# EAGLE schematic ADB (EAGLE 8.6.0)

## Sheet 1 of 2
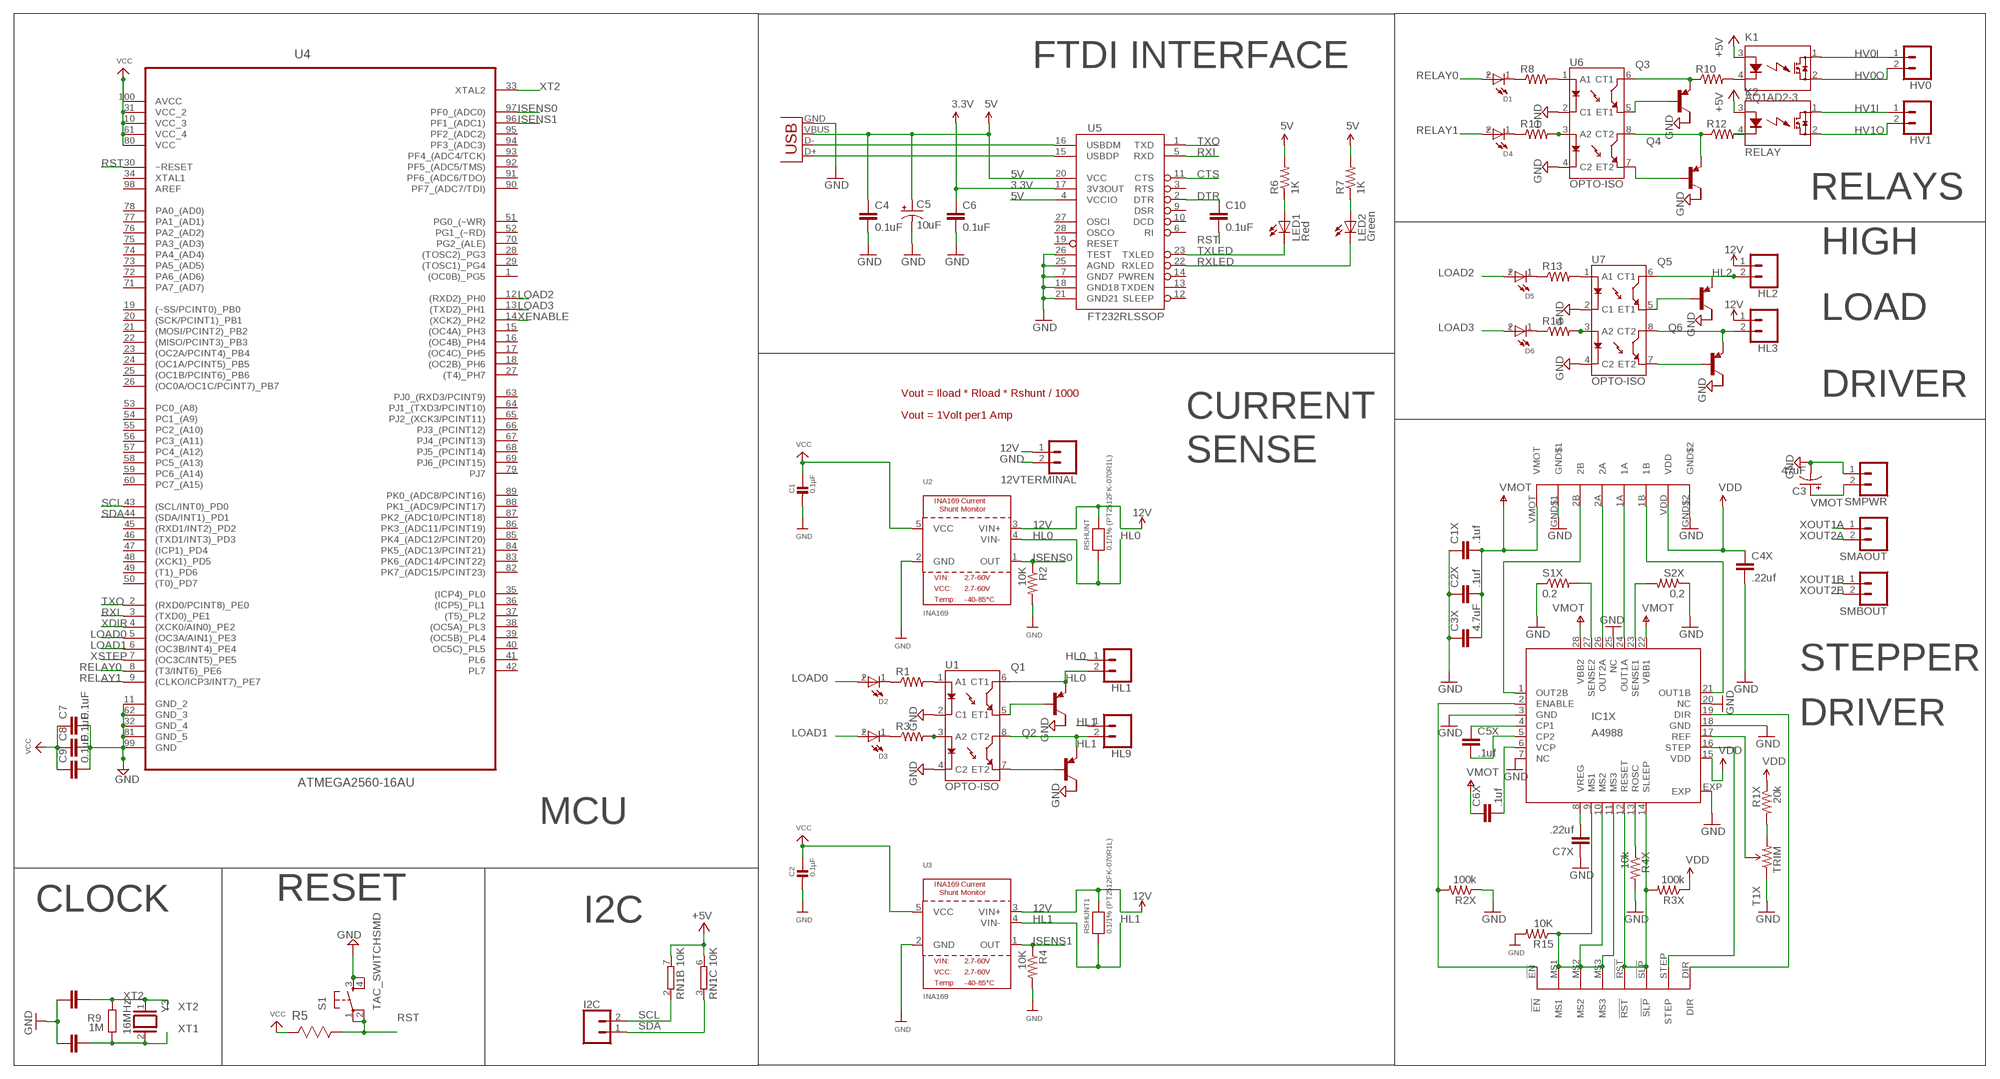
[diagram p0: schematic, sheet 1, part 1 of 2]
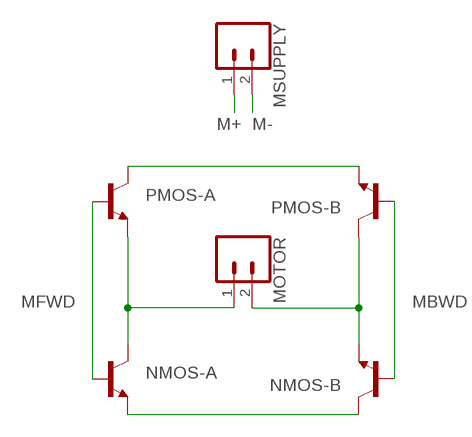
[diagram p1: schematic, sheet 1, part 2 of 2]

### Parts
12VTERMINAL  CONN_023.5MM_LOCK  [SCREWTERMINAL-3.5MM-2_LOCK]
C1  0.1µF  CAP_CERAMIC0805  [0805]
C1X  .1uf  CAP0402-CAP  [0402-CAP]
C2  0.1µF  CAP_CERAMIC0805  [0805]
C2X  .1uf  CAP0402-CAP  [0402-CAP]
C3  47uF  47UF-POLAR-EIA3528-10V-10%  [EIA3528]
C3X  4.7uF  CAP1206  [1206]
C4  0.1uF  CAP0402-CAP  [0402-CAP]
C4X  .22uf  CAP0402-CAP  [0402-CAP]
C5  10uF  CAP_POL1206  [EIA3216]
C5X  .1uf  CAP0402-CAP  [0402-CAP]
C6  0.1uF  CAP0402-CAP  [0402-CAP]
C6X  .1uf  CAP0402-CAP  [0402-CAP]
C7  0.1uF  0.1UF-0603-25V-(+80/-20%)  [0603]
C7X  .22uf  CAP0402-CAP  [0402-CAP]
C8  0.1uF  0.1UF-0603-25V-(+80/-20%)  [0603]
C9  0.1uF  0.1UF-0603-25V-(+80/-20%)  [0603]
C10  0.1uF  0.1UF-0603-25V-(+80/-20%)  [0603]
C23  22p  C-EU0603-RND  [C0603-ROUND]
C24  22p  C-EU0603-RND  [C0603-ROUND]
D1  WL-SMRW_1206_156120YS75000-Y  [WL-SMRW-1206-RECT]
D2  WL-SMRW_1206_156120YS75000-Y  [WL-SMRW-1206-RECT]
D3  WL-SMRW_1206_156120YS75000-Y  [WL-SMRW-1206-RECT]
D4  WL-SMRW_1206_156120YS75000-Y  [WL-SMRW-1206-RECT]
D5  WL-SMRW_1206_156120YS75000-Y  [WL-SMRW-1206-RECT]
D6  WL-SMRW_1206_156120YS75000-Y  [WL-SMRW-1206-RECT]
HL1  CONN_023.5MM_LOCK  [SCREWTERMINAL-3.5MM-2_LOCK]
HL2  CONN_023.5MM_LOCK  [SCREWTERMINAL-3.5MM-2_LOCK]
HL3  CONN_023.5MM_LOCK  [SCREWTERMINAL-3.5MM-2_LOCK]
HL9  CONN_023.5MM_LOCK  [SCREWTERMINAL-3.5MM-2_LOCK]
HV0  CONN_023.5MM_LOCK  [SCREWTERMINAL-3.5MM-2_LOCK]
HV1  CONN_023.5MM_LOCK  [SCREWTERMINAL-3.5MM-2_LOCK]
I2C  CONN_023.5MM_LOCK  [SCREWTERMINAL-3.5MM-2_LOCK]
IC1X  A4988  A4983  [QFN28ET]
J1X  CLONOLU  [CLONOLU]
K1  AQ1AD2-3  [AQ1]
K2  RELAY  AQ1AD2-3  [AQ1]
LED1  Red  LED0603  [LED-0603]
LED2  Green  LED0603  [LED-0603]
MOTOR  CONN_025MM  [SCREWTERMINAL-5MM-2]
MSUPPLY  CONN_025MM  [SCREWTERMINAL-5MM-2]
NMOS-A  TRANSISTOR_NPN"  [SOT223]
NMOS-B  TRANSISTOR_NPN"  [SOT223]
PMOS-A  TRANSISTOR_NPN"  [SOT223]
PMOS-B  TRANSISTOR_NPN"  [SOT223]
Q1  PNP-TRANSISTIOR-2COLSOT89  [SOT89]
Q2  PNP-TRANSISTIOR-2COLSOT89  [SOT89]
Q3  PNP-TRANSISTIOR-2COLSOT89  [SOT89]
Q4  PNP-TRANSISTIOR-2COLSOT89  [SOT89]
Q5  PNP-TRANSISTIOR-2COLSOT89  [SOT89]
Q6  PNP-TRANSISTIOR-2COLSOT89  [SOT89]
R1  FLIPFLOP-RES  [0805-THM]
R1X  20k  RESISTOR0402-RES  [0402-RES]
R2  10K  RESISTOR_DUAL  [0805-THM]
R2X  100k  RESISTOR0402-RES  [0402-RES]
R3  FLIPFLOP-RES  [0805-THM]
R3X  100k  RESISTOR0402-RES  [0402-RES]
R4  10K  RESISTOR_DUAL  [0805-THM]
R4X  10k  RESISTOR0402-RES  [0402-RES]
R5  CRM0805-FW-R050ELF  [RESC2013X65N]
R6  1K  RESISTOR0402-RES  [0402-RES]
R7  1K  RESISTOR0402-RES  [0402-RES]
R8  FLIPFLOP-RES  [0805-THM]
R9  1M  R-EU_R0603  [R0603-ROUND]
R10  FLIPFLOP-RES  [0805-THM]
R11  FLIPFLOP-RES  [0805-THM]
R12  FLIPFLOP-RES  [0805-THM]
R13  FLIPFLOP-RES  [0805-THM]
R14  FLIPFLOP-RES  [0805-THM]
R15  10K  RESISTOR_DUAL  [0805-THM]
RN1  10K  4R-NCAT16  [CAT16]
RSHUNT  0.1/1% (PT2512FK-070R1L)  RESISTOR2512  [2512]
RSHUNT1  0.1/1% (PT2512FK-070R1L)  RESISTOR2512  [2512]
S1  TAC_SWITCHSMD  [TACTILE-SWITCH-SMD]
S1X  0.2  RESISTOR  [0805]
S2X  0.2  RESISTOR  [0805]
SMAOUT  CONN_023.5MM_LOCK  [SCREWTERMINAL-3.5MM-2_LOCK]
SMBOUT  CONN_023.5MM_LOCK  [SCREWTERMINAL-3.5MM-2_LOCK]
SMPWR  CONN_023.5MM_LOCK  [SCREWTERMINAL-3.5MM-2_LOCK]
T1X  TRIM  TRIMPOTSMD  [TRIMPOT-3MM]
U1  OPTO-ISO  ILD213T-IDL213T  [SO08]
U2  INA169  [SOT23-5]
U3  INA169  [SOT23-5]
U4  ATMEGA2560-16AU  [QFP50P1600X1600X120-100N]
U5  FT232RLSSOP  [SSOP28DB]
U6  OPTO-ISO  ILD213T-IDL213T  [SO08]
U7  OPTO-ISO  ILD213T-IDL213T  [SO08]
X2  USB-SMD-NS  [USB-MINIB-NOSTOP]
Y3  16MHz  XTAL/S  [QS]

### Nets
3.3V [power]: C6.1 U5.17(3V3OUT)
5V: C4.1 C5.A(+) R6.2 R7.2 U5.4(VCCIO) U5.20(VCC) X2.VBUS
12V: 12VTERMINAL.1 HL2.1 HL3.1 RSHUNT1.2 RSHUNT.2 U2.3(VIN+) U3.3(VIN+)
+5V [power usb]: K1.3(A) K2.3(A) RN1.6 RN1.7
CTS: U5.11(CTS)
DTR: C10.1 U5.2(DTR)
GND: 12VTERMINAL.2 C1.2 C1X.1 C2.2 C2X.1 C3.C(-) C3X.1 C4.2 C4X.2 C5.C(-) C6.2 C7.2 C7X.1 C8.2 C9.2 C23.2 C24.2 IC1X.3(GND) IC1X.7(NC) IC1X.18(GND) IC1X.20(NC) IC1X.25(NC) IC1X.EXP J1X.GND$1(A4983$2:GND$1) J1X.GND$2(A4983$2:GND$2) Q1.2(C) Q2.2(C) Q3.2(C) Q4.2(C) Q5.2(C) Q6.2(C) R2.2 R2X.1 R4.2 R4X.2 R15.2 S1.3 S1.4 S1X.1 S2X.1 SMPWR.1 T1X.1(CCW) U1.2(C1) U1.4(C2) U2.2(GND) U3.2(GND) U4.11(GND_2) U4.32(GND_4) U4.62(GND_3) U4.81(GND_5) U4.99(GND) U5.7(GND7) U5.18(GND18) U5.21(GND21) U5.25(AGND) U5.26(TEST) U6.2(C1) U6.4(C2) U7.2(C1) U7.4(C2) X2.GND
HL0: HL1.1 HL1.2 Q1.3(E) RSHUNT.1 U1.6(CT1) U2.4(VIN-)
HL1: HL9.1 HL9.2 Q2.3(E) RSHUNT1.1 U1.8(CT2) U3.4(VIN-)
HL2: HL2.2 Q5.3(E) U7.6(CT1)
HL3: HL3.2 Q6.3(E) U7.8(CT2)
HV0I: HV0.1 K1.1(DS1)
HV0O: HV0.2 K1.2(DS2)
HV1I: HV1.1 K2.1(DS1)
HV1O: HV1.2 K2.2(DS2)
ISENS0: R2.1 U2.1(OUT) U4.97(PF0_(ADC0))
ISENS1: R4.1 U3.1(OUT) U4.96(PF1_(ADC1))
LOAD0: D2.2(+) U4.5((OC3A/AIN1)_PE3)
LOAD1: D3.2(+) U4.6((OC3B/INT4)_PE4)
LOAD2: D5.2(+) U4.12((RXD2)_PH0)
LOAD3: D6.2(+) U4.13((TXD2)_PH1)
M+: MSUPPLY.1
M-: MSUPPLY.2
MBWD: NMOS-B.1(B) PMOS-B.1(B)
MFWD: NMOS-A.1(B) PMOS-A.1(B)
N$1: R1.2 U1.1(A1)
N$2: D2.1(-) R1.1
N$3: R3.2 U1.3(A2)
N$4: D3.1(-) R3.1
N$5: Q1.1(B) U1.5(ET1)
N$6: MOTOR.1 NMOS-A.2(C) PMOS-A.3(E)
N$7: Q2.1(B) U1.7(ET2)
N$8: MOTOR.2 NMOS-B.3(E) PMOS-B.2(C)
N$9: LED1.A R6.1
N$10: LED2.A R7.1
N$11: R8.2 U6.1(A1)
N$12: D1.1(-) R8.1
N$13: R11.2 U6.3(A2)
N$14: D4.1(-) R11.1
N$15: Q3.3(E) R10.1 U6.6(CT1)
N$16: K1.4(K) R10.2
N$17: Q4.3(E) R12.1 U6.8(CT2)
N$18: K2.4(K) R12.2
N$19: Q3.1(B) U6.5(ET1)
N$20: Q4.1(B) U6.7(ET2)
N$21: R13.2 U7.1(A1)
N$22: D5.1(-) R13.1
N$23: R14.2 U7.3(A2)
N$24: D6.1(-) R14.1
N$25: Q5.1(B) U7.5(ET1)
N$26: Q6.1(B) U7.7(ET2)
N$27: PMOS-A.2(C) PMOS-B.3(E)
N$28: NMOS-A.3(E) NMOS-B.2(C)
RELAY0: D1.2(+) U4.8((T3/INT6)_PE6)
RELAY1: D4.2(+) U4.9((CLKO/ICP3/INT7)_PE7)
RST: C10.2 R5.1(R1) S1.1 S1.2 U4.30(~RESET)
RXI: U4.3((TXD0)_PE1) U5.5(RXD)
RXLED: LED2.C U5.22(RXLED)
SCL: I2C.2 RN1.2 U4.43((SCL/INT0)_PD0)
SDA: I2C.1 RN1.3 U4.44((SDA/INT1)_PD1)
TXLED: LED1.C U5.23(TXLED)
TXO: U4.2((RXD0/PCINT8)_PE0) U5.1(TXD)
USB_D+: U5.15(USBDP) X2.D+
USB_D-: U5.16(USBDM) X2.D-
VCC: C1.1 C2.1 C7.1 C8.1 C9.1 R5.2(R2) U2.5(VCC) U3.5(VCC) U4.10(VCC_3) U4.31(VCC_2) U4.61(VCC_4) U4.80(VCC) U4.100(AVCC)
VDD: C4X.1 IC1X.15(VDD) J1X.VDD(A4983$2:VDD) R1X.1 R3X.1
VMOT: C1X.2 C2X.2 C3.A(+) C3X.2 C6X.1 IC1X.22(VBB1) IC1X.28(VBB2) J1X.VMOT(A4983$2:VMOT) SMPWR.2
XCP1: C5X.1 IC1X.4(CP1)
XCP2: C5X.2 IC1X.5(CP2)
XDIR: IC1X.19(DIR) J1X.DIR(A4983$1:DIR) U4.4((XCK0/AIN0)_PE2)
XENABLE: IC1X.2(ENABLE) J1X.!EN(A4983$1:!EN) R2X.2 U4.14((XCK2)_PH2)
XMS1: IC1X.9(MS1) IC1X.10(MS2) IC1X.11(MS3) J1X.MS1(A4983$1:MS1) J1X.MS2(A4983$1:MS2) J1X.MS3(A4983$1:MS3) R15.1
XOUT1A: IC1X.24(OUT1A) J1X.1A(A4983$2:1A) SMAOUT.1
XOUT1B: IC1X.21(OUT1B) J1X.1B(A4983$2:1B) SMBOUT.1
XOUT2A: IC1X.26(OUT2A) J1X.2A(A4983$2:2A) SMAOUT.2
XOUT2B: IC1X.1(OUT2B) J1X.2B(A4983$2:2B) SMBOUT.2
XREF: IC1X.17(REF) T1X.2(WIPER)
XREF2: R1X.2 T1X.3(CW)
XRESET: IC1X.12(RESET) IC1X.14(SLEEP) J1X.!RST(A4983$1:!RST) J1X.!SLP(A4983$1:!SLP) R3X.2
XROSC: IC1X.13(ROSC) R4X.1
XSENSE1: IC1X.23(SENSE1) S2X.2
XSENSE2: IC1X.27(SENSE2) S1X.2
XSTEP: IC1X.16(STEP) J1X.STEP(A4983$1:STEP) U4.7((OC3C/INT5)_PE5)
XT1: C23.1 R9.1 Y3.2
XT2: C24.1 R9.2 U4.33(XTAL2) Y3.1
XVCP: C6X.2 IC1X.6(VCP)
XVREG: C7X.2 IC1X.8(VREG)
Unconnected: Q1.2@1(C/) Q2.2@1(C/) Q3.2@1(C/) Q4.2@1(C/) Q5.2@1(C/) Q6.2@1(C/) RN1.1 RN1.4 RN1.5 RN1.8 U4.1((OC0B)_PG5) U4.15((OC4A)_PH3) U4.16((OC4B)_PH4) U4.17((OC4C)_PH5) U4.18((OC2B)_PH6) U4.19((~SS/PCINT0)_PB0) U4.20((SCK/PCINT1)_PB1) U4.21((MOSI/PCINT2)_PB2) U4.22((MISO/PCINT3)_PB3) U4.23((OC2A/PCINT4)_PB4) U4.24((OC1A/PCINT5)_PB5) U4.25((OC1B/PCINT6)_PB6) U4.26((OC0A/OC1C/PCINT7)_PB7) U4.27((T4)_PH7) U4.28((TOSC2)_PG3) U4.29((TOSC1)_PG4) U4.34(XTAL1) U4.35((ICP4)_PL0) U4.36((ICP5)_PL1) U4.37((T5)_PL2) U4.38((OC5A)_PL3) U4.39((OC5B)_PL4) U4.40(OC5C)_PL5) U4.41(PL6) U4.42(PL7) U4.45((RXD1/INT2)_PD2) U4.46((TXD1/INT3)_PD3) U4.47((ICP1)_PD4) U4.48((XCK1)_PD5) U4.49((T1)_PD6) U4.50((T0)_PD7) U4.51(PG0_(~WR)) U4.52(PG1_(~RD)) U4.53(PC0_(A8)) U4.54(PC1_(A9)) U4.55(PC2_(A10)) U4.56(PC3_(A11)) U4.57(PC4_(A12)) U4.58(PC5_(A13)) U4.59(PC6_(A14)) U4.60(PC7_(A15)) U4.63(PJ0_(RXD3/PCINT9)) U4.64(PJ1_(TXD3/PCINT10)) U4.65(PJ2_(XCK3/PCINT11)) U4.66(PJ3_(PCINT12)) U4.67(PJ4_(PCINT13)) U4.68(PJ5_(PCINT14)) U4.69(PJ6_(PCINT15)) U4.70(PG2_(ALE)) U4.71(PA7_(AD7)) U4.72(PA6_(AD6)) U4.73(PA5_(AD5)) U4.74(PA4_(AD4)) U4.75(PA3_(AD3)) U4.76(PA2_(AD2)) U4.77(PA1_(AD1)) U4.78(PA0_(AD0)) U4.79(PJ7) U4.82(PK7_(ADC15/PCINT23)) U4.83(PK6_(ADC14/PCINT22)) U4.84(PK5_(ADC13/PCINT21)) U4.85(PK4_(ADC12/PCINT20)) U4.86(PK3_(ADC11/PCINT19)) U4.87(PK2_(ADC10/PCINT18)) U4.88(PK1_(ADC9/PCINT17)) U4.89(PK0_(ADC8/PCINT16)) U4.90(PF7_(ADC7/TDI)) U4.91(PF6_(ADC6/TDO)) U4.92(PF5_(ADC5/TMS)) U4.93(PF4_(ADC4/TCK)) U4.94(PF3_(ADC3)) U4.95(PF2_(ADC2)) U4.98(AREF) U5.3(RTS) U5.6(RI) U5.9(DSR) U5.10(DCD) U5.12(SLEEP) U5.13(TXDEN) U5.14(PWREN) U5.19(RESET) U5.27(OSCI) U5.28(OSCO)

### Notes on the sheet
- FTDI INTERFACE
- RELAYS
- HIGH
- LOAD
- Vout = Iload * Rload * Rshunt / 1000 | DRIVER
- Vout = 1Volt per1 Amp | CURRENT
- SENSE
- STEPPER
- DRIVER
- MCU
- CLOCK | RESET
- I2C

## Sheet 2 of 2

## Library data of the parts
12VTERMINAL HL1-HL3 HL9 HV0 HV1 I2C SMAOUT SMBOUT SMPWR = SparkFun-Retired:CONN_02: Multi connection point. Often used as Generic Header-pin footprint for 0.1 inch spaced/style header connections On any of the 0.1 inch spaced packages, you can populate with these: Break Away Headers - Straight <https://www.sparkfun.com/products/116> (PRT-00116) Break Away Male Headers - Right Angle <https://www.sparkfun.com/products/553> (PRT-00553) Female Headers <https://www.sparkfun.com/products/115> (PRT-00115) Break Away Headers - Machine Pin <https://www.sparkfun.com/products/117> (PRT-00117) Break Away Female Headers - Swiss Machine Pin <https://www.sparkfun.com/products/743> (PRT-00743) For SCREWTERMINALS and SPRING TERMINALS visit here: Screw Terimnals on SparkFun.com <https://www.sparkfun.com/search/results?term=Screw+Terminals> (5mm/3.5mm/2.54mm spacing) This device is also useful as a general connection point to wire up your design to another part of your project. Our various solder wires solder well into these plated through hole pads. Hook-Up Wire - Assortment (Stranded, 22 AWG) <https://www.sparkfun.com/products/11375> (PRT-11375) Hook-Up Wire - Assortment (Solid Core, 22 AWG) <https://www.sparkfun.com/products/11367> (PRT-11367) View the entire wire category on our website here <https://www.sparkfun.com/categories/141> Special notes: Molex polarized connector foot print use with: PRT-08233 with associated crimp pins and housings. 2.54_SCREWTERM for use with PRT-10571. 3.5mm Screw Terminal footprints for PRT-08084 5mm Screw Terminal footprints for use with PRT-08432; PROD_ID: CONN-08399
C1 C2 = microbuilder:CAP_CERAMIC: Ceramic Capacitors For new designs, use the packages preceded by an '_' character since they are more reliable: The following footprints should be used on most boards: _0402 - Standard footprint for regular board layouts _0603 - Standard footprint for regular board layouts _0805 - Standard footprint for regular board layouts For extremely tight-pitch boards where space is at a premium, the following 'micro-pitch' footprints can be used (smaller pads, no silkscreen outline, etc.): _0402MP - Micro-pitch footprint for very dense/compact boards _0603MP - Micro-pitch footprint for very dense/compact boards _0805MP - Micro-pitch footprint for very dense/compact boards Commonly Stocked Parts 0402 - 0402 Surface Mount Capacitors 16pF 50V 5% [Digikey: 445-4899-2-ND] 18pF 50V 5% [Digikey: 490-1281-2-ND] 22pF 50V 5% [Digikey: 490-1283-2-ND] 68pF 50V 5% [Digikey: 490-1289-2-ND] 0.1uF 10V 10% [Digikey: 490-1318-2-ND] 1.0uF 6.3V 10% [Digikey: 490-1320-2-ND] 0603 - 0603 Surface Mount Capacitors 16 pF 50V 5% [Digikey: 445-5051-2-ND] 22 pF 50V [Digikey: PCC220ACVTR-ND] 33 pF 50V 5% [Digikey: 490-1415-1-ND] 56pF 50V 5% [Digikey: 490-1421-1-ND] 220pF 50V 5% [Digikey: 445-1285-1-ND] 680 pF 50V 2200 pF 50V 5% C0G [Digikey: 445-1297-1-ND] 5600 pF 100V 5% X7R [Digikey: 478-3711-1-ND] 0.1 µF 25V 10% [Digikey: PCC2277TR-ND] 0.22 µF 16V 10% X7R [Digikey: 445-1318-1-ND] 1.0 µF 25V 10% [Digikey: 445-5146-2-ND] 0603 - RF Specific 3pF 250V +/-0.1pF RF [Digikey: 712-1347-1-ND] 18 pF 250V 5% [Digikey: 478-3505-1-ND or 712-1322-1-ND] 56 pF 250V 5% C0G RF [Digikey: 490-4867-1-ND] 68 pF 250V RF [Digikey: 490-4868-1-ND] 0805 - 0805 Surface Mount Capacitors 220 pF 250V 2% RF Ceramic Capacitor [Digikey: 712-1398-1-ND] 1000 pF 50V 2% NP0 Ceramic Capacitor [Digikey: 478-3760-1-ND] 0.1 µF 25V 10% Ceramic Capacitor [Digikey: PCC1828TR-ND] 1.0 µF 16V 10% Ceramic Capacitor[Digikey: 490-1691-2-ND] 10.0 µF 10V 10% Ceramic Capacitor[Digikey: 709-1228-1-ND] 10.0 uF 16V 10% Ceramic Capacitor [Digikey: 478-5165-2-ND] 47 uF 6.3V 20% Ceramic Capacitor [Digikey: 587-1779-1-ND or 399-5506-1-ND] 1206 - 1206 Surface Mount Capacitors 47uF 10V 20% Ceramic Capacitor [Digikey: 490-5528-1-ND or 399-5508-1-ND or 445-6010-1-ND] 100uF 6.3V -20%, +80% Y5V Ceramic Capacitor (Digikey: 490-4512-1-ND, Mouser: 81-GRM31CF50J107ZE1L)
C1X C2X C3X C4 C4X C5X C6 C6X C7X = SparkFun:CAP: Capacitor Standard 0603 ceramic capacitor, and 0.1" leaded capacitor.
C3 = SparkFun-Capacitors:47UF-POLAR: 47µF polarized capacitors A capacitor is a passive two-terminal electrical component used to store electrical energy temporarily in an electric field.; PROD_ID: CAP-08310
C5 = SparkFun:CAP_POL: Capacitor Polarized These are standard SMD and PTH capacitors. Normally 10uF, 47uF, and 100uF in electrolytic and tantalum varieties. Always verify the external diameter of the through hole cap, it varies with capacity, voltage, and manufacturer. The EIA devices should be standard.
C7-C10 = SparkFun-Capacitors:0.1UF: 0.1µF ceramic capacitors A capacitor is a passive two-terminal electrical component used to store electrical energy temporarily in an electric field.; PROD_ID: CAP-00810
C23 C24 = SmartPrj:C-EU: CAPACITOR, European symbol
D1-D6 = Wurth_Elektronik_Optoelectronics_rev18a:WL-SMRW_1206: WL-SMRW SMD Mono-color Reverse mount Waterclear Characteristics Ideal for narrow space applications Narrow viewing angle Low power consumption Industry standard footprint Small package for exceptional brightness To emit light through a small cut-out hole in PCB Compatible with automatic placement machine Applications Front panels indicators LCD backlighting Backlighting for keypad, symbol and switch button Messaenger board Networking and telecommunications Mobile devices Instrumentation Fitness wearables Audio and video Medical and healthcare <http://katalog.we-online.de/media/images/v2/Family_WL-SMRW_neu.jpg> Details see: http://katalog.we-online.de/en/led/WL-SMRW?m <http://katalog.we-online.de/media/images/v2/Family_WL-SMRW_neu.jpg> Details see: http://katalog.we-online.de/en/led/WL-SMRW?m Updated 2015-04-10 2015 (C) Wurth Elektronik
IC1X = allegro:A4983: DMOS Microstepping Driver with Translator Auto generated by make-symbol-device-package-bsdl.ulp Rev. 32 Source: http://www.allegromicro.com/en/Products/Part_Numbers/4983/4983.pdf; MPN: A4983SETTR-T; OC_FARNELL: 1688956; OC_NEWARK: 39M6763
J1X = pololu-allegro:CLONOLU
K1 K2 = relay:AQ*: SOLID STATE RELAY NAiS Source: http://www.mew-europe.com/.. en_ds_61601_0000.pdf; MF: AROMAT/ MATSUSHITA; MPN: AQ1AD2-3/28VDC; OC_FARNELL: unknown; OC_NEWARK: 10C4052
LED1 LED2 = SparkFun:LED: LEDs Standard schematic elements and footprints for 5mm, 3mm, 1206, and 0603 sized LEDs. 5mm - Spark Fun Electronics SKU : COM-00529 (and others)
MOTOR MSUPPLY = SparkFun-Connectors:CONN_02: Multi connection point. Often used as Generic Header-pin footprint for 0.1 inch spaced/style header connections On any of the 0.1 inch spaced packages, you can populate with these: Break Away Headers - Straight <https://www.sparkfun.com/products/116> (PRT-00116) Break Away Male Headers - Right Angle <https://www.sparkfun.com/products/553> (PRT-00553) Female Headers <https://www.sparkfun.com/products/115> (PRT-00115) Break Away Headers - Machine Pin <https://www.sparkfun.com/products/117> (PRT-00117) Break Away Female Headers - Swiss Machine Pin <https://www.sparkfun.com/products/743> (PRT-00743) For SCREWTERMINALS and SPRING TERMINALS visit here: Screw Terimnals on SparkFun.com <https://www.sparkfun.com/search/results?term=Screw+Terminals> (5mm/3.5mm/2.54mm spacing) This device is also useful as a general connection point to wire up your design to another part of your project. Our various solder wires solder well into these plated through hole pads. Hook-Up Wire - Assortment (Stranded, 22 AWG) <https://www.sparkfun.com/products/11375> (PRT-11375) Hook-Up Wire - Assortment (Solid Core, 22 AWG) <https://www.sparkfun.com/products/11367> (PRT-11367) View the entire wire category on our website here <https://www.sparkfun.com/categories/141> Special notes: Molex polarized connector foot print use with: PRT-08233 with associated crimp pins and housings. 2.54_SCREWTERM for use with PRT-10571. 3.5mm Screw Terminal footprints for PRT-08084 5mm Screw Terminal footprints for use with PRT-08432; SF_SKU: PRT-08432
NMOS-A NMOS-B PMOS-A PMOS-B = digikey:TRANSISTOR_NPN: Generic NPN BJT MMBT2222A - TRANS-08049 (SOT-23, 1A 40V) MPSA42 - TRANS-09116 (SOT-23, 500mA 300V) MMBT5088LT1G - TRANS-11160 (SOT-23, 50 mA 30V)
Q1-Q6 = semicon-smd-ipc:PNP-TRANSISTIOR-2COL: PNP TRANSISTOR 2 colletor pins
R1 R3 R8 R10-R14 = adafruit:FLIPFLOP-RES: Flip Flop resistor An 0805 resistor inside a standard 1/4W 5% resistor. Makes for easy mods
R1X R2X R3X R4X R6 R7 S1X S2X = SparkFun:RESISTOR: Resistor Basic schematic elements and footprints for 0603, 1206, and PTH 1/10th watt (small) resistors.
R2 R4 R15 = microbuilder:RESISTOR_DUAL: Flip Flop resistor An 0805 resistor inside a standard 1/4W 5% resistor. Makes for easy mods Footprint taken from the Adafruit Industries Eagle Library.
R5 = Bourns_By_element14_Batch_1:CRM0805-FW-R050ELF: Resistor 0805; MPN: CRM0805-FW-R050ELF; OC_FARNELL: 1865234; OC_NEWARK: 17T4231; SUPPLIER: BOURNS; TOLERANCE: ±1 %; VALUE: 0.05 Ohm; WATTAGE: 0.25 W
R9 = SmartPrj:R-EU_: RESISTOR, European symbol
RN1 = resistor-dil:4R-N: Array Chip Resistor Source: RS Component / Phycomp
RSHUNT RSHUNT1 = microbuilder:RESISTOR: Resistors For new designs, use the packages preceded by an '_' character since they are more reliable: The following footprints should be used on most boards: _0402 - Standard footprint for regular board layouts _0603 - Standard footprint for regular board layouts _0805 - Standard footprint for regular board layouts For extremely tight-pitch boards where space is at a premium, the following 'micro-pitch' footprints can be used (smaller pads, no silkscreen outline, etc.): _0402MP - Micro-pitch footprint for very dense/compact boards _0603MP - Micro-pitch footprint for very dense/compact boards _0805MP - Micro-pitch footprint for very dense/compact boards
S1 = SparkFun-Retired:TAC_SWITCH: Momentary Switch Button commonly used for reset or general input. Spark Fun Electronics SKU : COM-00097 SMT- SWCH-08247; PROD_ID: SWCH-08247
T1X = SparkFun:TRIMPOT
U1 U6 U7 = SparkFun-DiscreteSemi:ILD213T: Dual Channel Phototransistor Optocoupler Dual Channel 70 V 4000 Vrms Phototransistor Optocoupler in a standard SOIC-8 package. Used to couple signals between electrically isolated circuits. Datasheet <https://www.sparkfun.com/datasheets/Components/SMD/ild205t.pdf> SparkFun Products: SparkFun Opto-Isolator Breakout <https://www.sparkfun.com/products/9118>; PROD_ID: IC-09076
U2 U3 = microbuilder:INA169: INA169 - High-Side Measurement Current Shunt Monitor The device converts a differential input voltage to a current output. This current is converted back to a voltage with an external load resistor that sets any gain from 1 to over 100.
U4 = Atmel_By_element14_Batch_1-00:ATMEGA2560-16AU: Microcontroller; DESCRIPTION: Microcontroller; MPN: ATMEGA2560-16AU; OC_FARNELL: 1288330; OC_NEWARK: 23M5051; PACKAGE: LQFP-100; SUPPLIER: ATMEL
U5 = SparkFun:FT232RL: USB UART FT232RL 4th Generation USB UART (USB <-> Serial) Controller. Spark Fun Electronics SKU : COM-00650
X2 = SparkFun:USB: USB Connectors USB-B-PTH is fully proven SKU : PRT-00139 USB-miniB is fully proven SKU : PRT-00587 USB-A-PCB is untested. USB-A-H is throughly reviewed, but untested. Spark Fun Electronics SKU : PRT-00437 USB-B-SMT is throughly reviewed, but untested. Needs silkscreen touching up. USB-A-S has not been used/tested USB-MB-H has not been used/tested
Y3 = SmartPrj:XTAL/S: CRYSTAL

## Net classes
1 power: width 0.254 mm
2 gnd: width 0.305 mm, drill 0.406 mm, clearance 0.203 mm
3 power usb: width 0.508 mm, drill 0.406 mm, clearance 0.203 mm